# Altium schematic sheet dac_DAC1220.SchDoc: 20-bit Digital to Analog Converter DAC1220
size A4
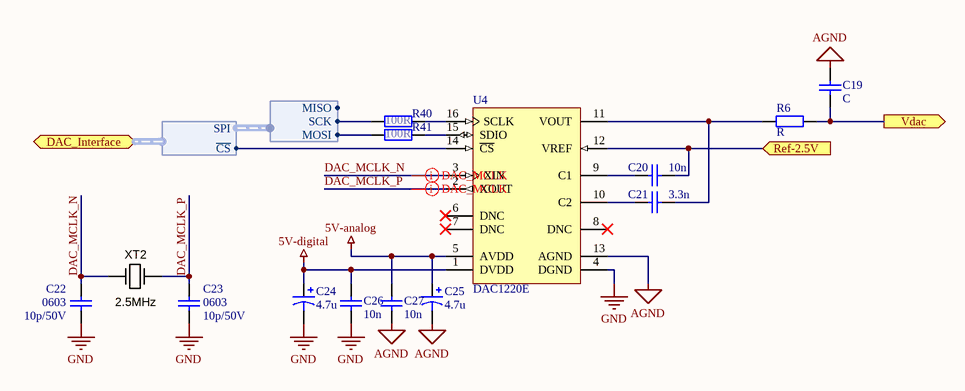
[diagram p0: dac_DAC1220.SchDoc]

## Parts
C19  C  [C0603]
C20  10n  [C0603]
C21  3.3n  [C0603]
C22  Package: 0603  [SMD_Capacitor_0603]  (hidden comment: 10p/50V)
C23  Package: 0603  [SMD_Capacitor_0603]  (hidden comment: 10p/50V)
C24  4.7u  [Tantalum_cap_B]
C25  4.7u  [Tantalum_cap_B]
C26  10n  [C0603]
C27  10n  [C0603]
R6  R  [0603]
R40  100R  [0603]
R41  100R  [0603]
U4  DAC1220E  [TI-DBQ16_N]
XT2  2.5MHz  [HC49U]

## Ports
DAC_Interface (harness DAC_DIGITAL), Ref-2.5V (in), Vdac (out)

## Harnesses
DAC_DIGITAL: SPI, ~{CS}
SPI: SCK, MOSI, MISO

## Nets
5V-analog: C25.1 C27.1 U4.5(AVDD)
5V-digital: C24.1 C26.1 U4.1(DVDD)
AGND: C19.2 C25.2 C27.2 U4.13(AGND)
GND: C22.2 C23.2 C24.2 C26.2 U4.4(DGND)
DAC_MCLK_N: C22.1 U4.3(XIN) XT2.1(IN)
DAC_MCLK_P: C23.1 U4.2(XOUT) XT2.2(OUT)
Ref-2.5V: C20.2 U4.12(VREF) ; port Ref-2.5V
Vdac: C19.1 R6.2 ; port Vdac
NetC20_1: C20.1 U4.9(C1)
NetC21_1: C21.1 U4.10(C2)
NetC21_2: C21.2 R6.1 U4.11(VOUT)
NetR40_1: R40.1 ; harness SPI.SCK
NetR40_2: R40.2 U4.16(SCLK)
NetR41_1: R41.1 ; harness SPI.MOSI
NetR41_2: R41.2 U4.15(SDIO)
NetU4_14: U4.14(~{CS}) ; port DAC_Interface.~{CS}

Not connected (* = marked no-connect by the designer): U4 6(DNC)* 7(DNC)* 8(DNC)*

## Layout directives
differential pair: DAC_MCLK_N, DAC_MCLK_P

## Notes on the sheet
- Title:
- Sheet:
- of
- Author:
- Model:
- Document Number:
- Checked by:
- Iss-Rev:
- Approved by:
- Date:
- File name:

## Library data of the parts
C19-C21 C26 C27 = Cap: Generic capacitor
  C19: value: C
  C20 C26 C27: value: 10n
  C21: value: 3.3n
C22 C23 = Cer_GCM1885C1H100JA16D: Ceramic Cap Murata Automotive 10p/50V C0G 0603; Manufacturer: Murata; ManufacturerPartNumber: GCM1885C1H100JA16D; Value: 10p/50V
C24 C25 = Cap Pol: Polarized Capacitor; Value: 4.7u
R6 R40 R41 = Res: Generic resistor
  R6: value: R
  R40 R41: value: 100R
U4 = DAC1220E: 20-Bit Delta-Sigma Low Power DAC, -40 to 85 degC, 16-pin SOP (DBQ16), Green (RoHS & no Sb/Br); Manufacturer: Texas Instruments; DAC Channels: 1; Interface: Serial SPI; Power Consumption(Typ)(mW): 2.5; Resolution(Bits): 20; Settling Time(us): 2000; SubFamily: Precision DAC (=<10MSPS); DatasheetVersion: SBAS082G; PackageVersion: 4073301-2/H, 10/2008; PackageReference: DBQ16; PackageDescription: 16-Pin Plastic Small Outline, Body 3.9 x 4.9 mm, Pitch 0.635 mm; Supplier 1: Digi-Key; Supplier Part Number 1: DAC1220E-ND; Supplier 2: Farnell; Supplier Part Number 2: 1097447; Supplier 3: Newark; Supplier Part Number 3: 74K3713; Supplier 4: Mouser; Supplier Part Number 4: 595-DAC1220E; DNL(Max)(+/-LSB): 1; Eco-Plan: Green (RoHS & no Sb/Br); INL(Max)(+/-LSB): 1; Mounting Technology: Surface Mount; Code_JEDEC: MO-137; PartNumber: DAC1220E; ComponentLink1Description: Manufacturer URL; ComponentLink1URL: http://www.ti.com/; ComponentLink2Description: Datasheet; ComponentLink2URL: http://www.ti.com/general/docs/lit/getliterature.tsp?genericPartNumber=DAC1220&fileType=pdf; ComponentLink3Description: Package Specification; ComponentLink3URL: http://www.ti.com/litv/pdf/msoi004g
XT2 = Crystal: AKER  C-2.4576-18-3050-X; Manufacturer 1: Citizen Finetech Miyota; Manufacturer Part Number 1: CMR309T-6.000MABJ-UT; Ratings: 6.00 MHz; Frequency: 6MHz; Frequency Stability: ±50ppm; Frequency Tolerance: ±30ppm; Load Capacitance: 18pF; Operating Mode: Fundamental; SCDType: spec; Package / Case: Cylindrical Can, Radial; Type: MHz Crystal; Operating Temperature: -10°C ~ 60°C; Mounting Type: Surface Mount; Size / Dimension: 0.118" Dia x 0.346" L (3.00mm x 8.80mm); Height: 0.122" (3.10mm); Supplier 1: Digi-Key; Supplier Part Number 1: 300-8348-1-ND; Tolerance: ±50ppm; ComponentLink1URL: http://media.digikey.com/pdf/Data%20Sheets/Citizen%20PDFs/CMR310T%20CMR309T.pdf; ComponentLink1Description: http://media.digikey.com/pdf/Data%20Sheets/Citizen%20PDFs/CMR310T%20CMR309T.pdf; Value: 2.5MHz